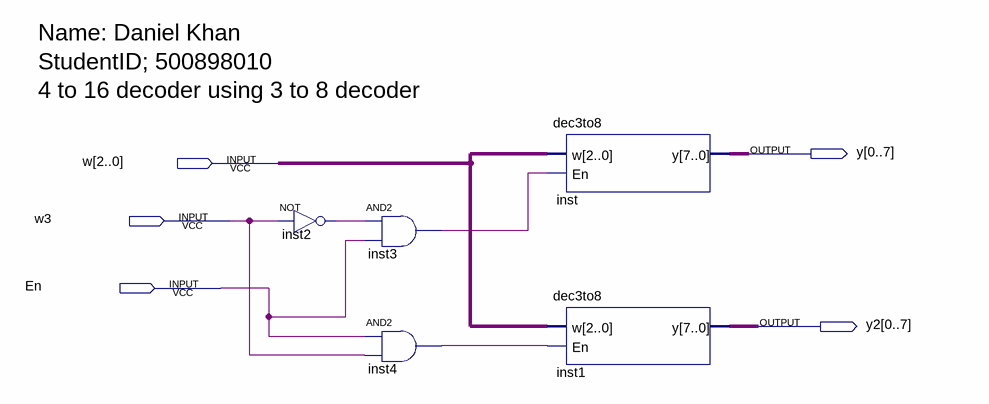
[diagram p0: schematic sheet]
// Quartus schematic dec4to16test.bdf as structural Verilog: 5 symbols, 5 pins
module dec4to16test (
  input  [2:0] w,
  input  w3,
  input  En,
  output [0:7] y,
  output [0:7] y2
);

  wire inst2_out, inst3_out, inst4_out;

  not inst2 (inst2_out, w3);
  and inst3 (inst3_out, inst2_out, En);
  and inst4 (inst4_out, En, w3);
  dec3to8 inst (.w(w), .En(inst3_out), .y(y));
  dec3to8 inst1 (.w(w), .En(inst4_out), .y(y2));

  // Notes on the sheet:
  //   Name: Daniel Khan
  //   StudentID; 500898010
  //   4 to 16 decoder using 3 to 8 decoder
endmodule
